# EAGLE design pca9685_32_V1 (EAGLE 6.2)
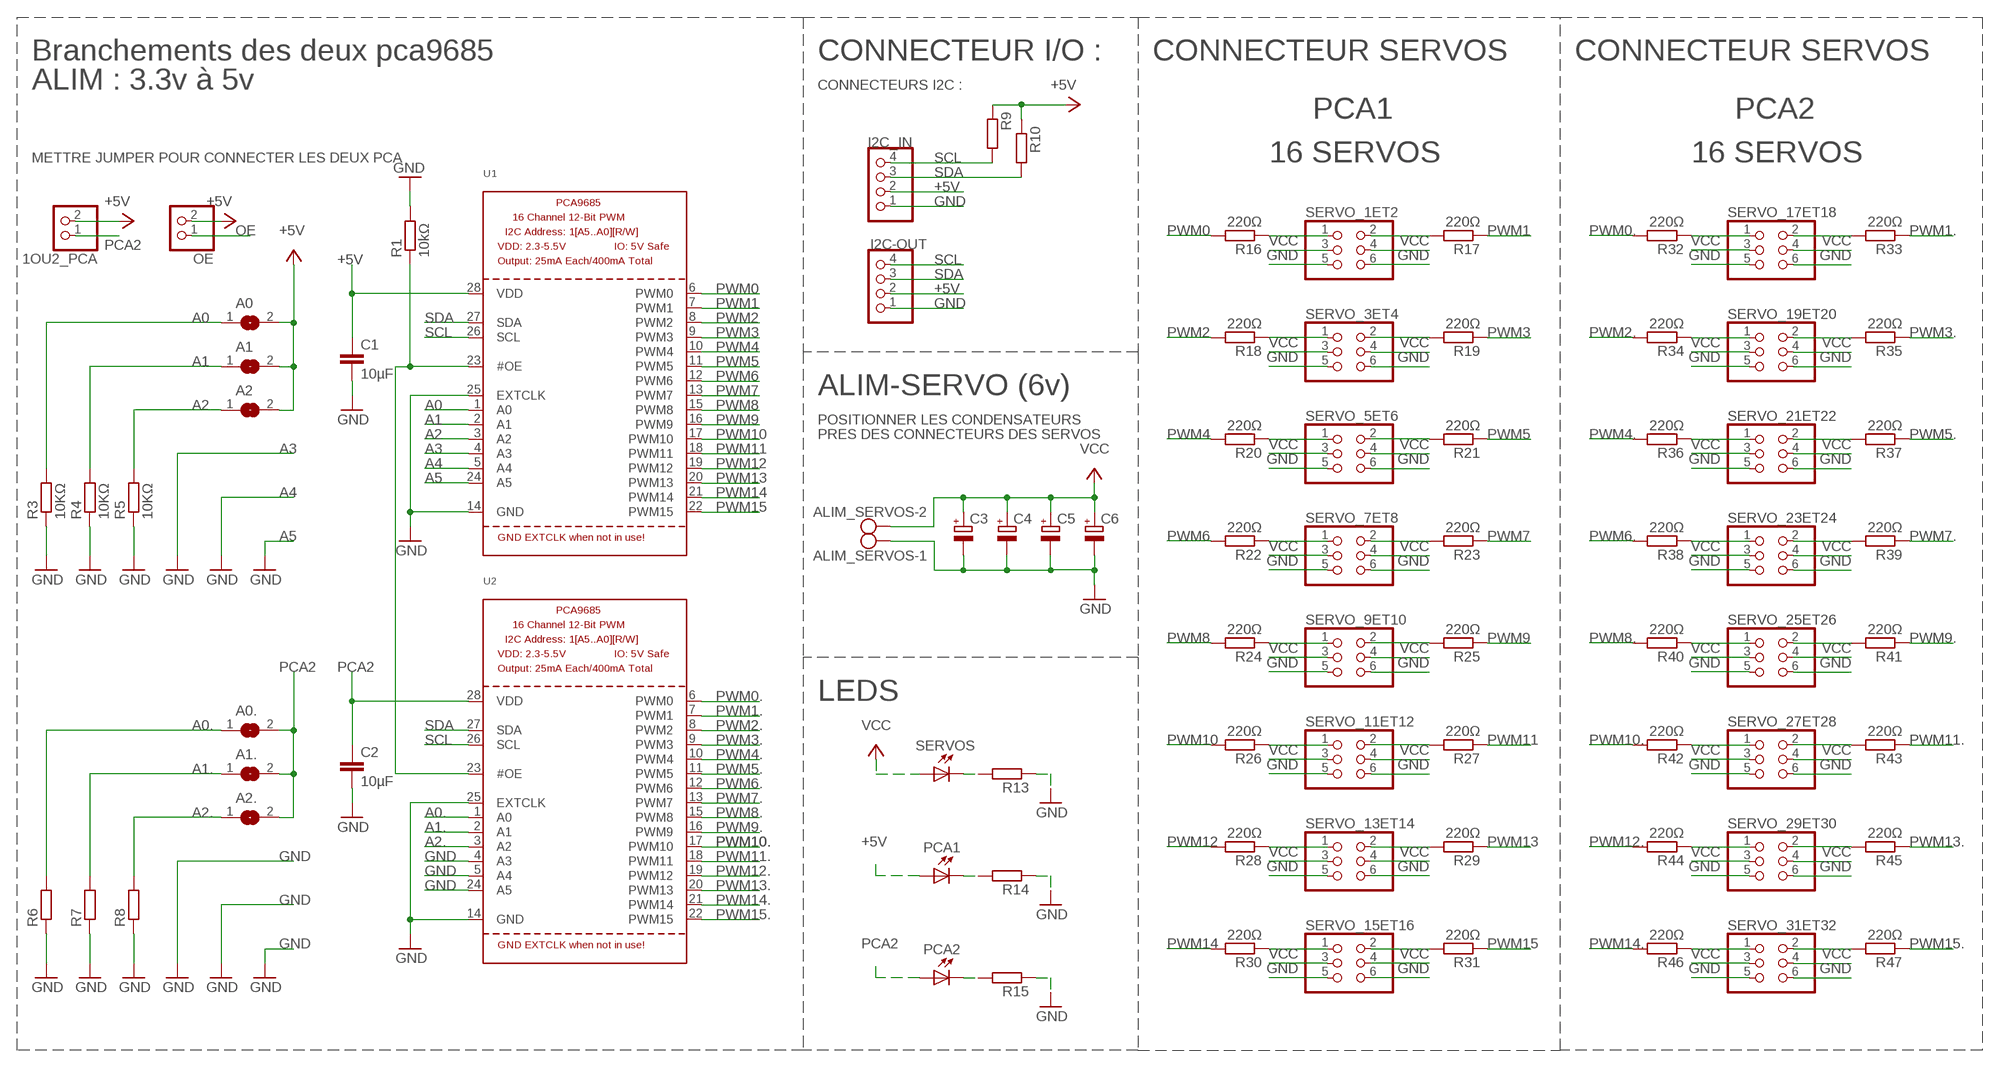
[diagram p0: schematic, sheet 1]

## Parts
1OU2_PCA  PINHD-1X2  [1X02]
A0  SOLDERJUMPERREFLOW_NOPASTE  [SOLDERJUMPER_REFLOW_NOPASTE]
A0.  SOLDERJUMPERREFLOW_NOPASTE  [SOLDERJUMPER_REFLOW_NOPASTE]
A1  SOLDERJUMPERREFLOW_NOPASTE  [SOLDERJUMPER_REFLOW_NOPASTE]
A1.  SOLDERJUMPERREFLOW_NOPASTE  [SOLDERJUMPER_REFLOW_NOPASTE]
A2  SOLDERJUMPERREFLOW_NOPASTE  [SOLDERJUMPER_REFLOW_NOPASTE]
A2.  SOLDERJUMPERREFLOW_NOPASTE  [SOLDERJUMPER_REFLOW_NOPASTE]
ALIM_SERVOS  AK500/2  [AK500/2]
C1  10µF  C-EUC0805  [C0805]
C2  10µF  C-EUC0805  [C0805]
C3  CPOL-EUE3.5-10  [E3,5-10]
C4  CPOL-EUE3.5-10  [E3,5-10]
C5  CPOL-EUE3.5-10  [E3,5-10]
C6  CPOL-EUE3.5-10  [E3,5-10]
I2C-OUT  PINHD-1X4  [1X04]
I2C_IN  PINHD-1X4  [1X04]
OE  PINHD-1X2  [1X02]
PCA1  LEDCHIP-LED0805  [CHIP-LED0805]
PCA2  LEDCHIP-LED0805  [CHIP-LED0805]
R1  10kΩ  R-EU_R0805  [R0805]
R3  10KΩ  R-EU_R1206  [R1206]
R4  10KΩ  R-EU_R1206  [R1206]
R5  10KΩ  R-EU_R1206  [R1206]
R6  R-EU_R1206  [R1206]
R7  R-EU_R1206  [R1206]
R8  R-EU_R1206  [R1206]
R9  R-EU_R0805  [R0805]
R10  R-EU_R0805  [R0805]
R13  R-EU_R0805  [R0805]
R14  R-EU_R0805  [R0805]
R15  R-EU_R0805  [R0805]
R16  220Ω  R-EU_R0805  [R0805]
R17  220Ω  R-EU_R0805  [R0805]
R18  220Ω  R-EU_R0805  [R0805]
R19  220Ω  R-EU_R0805  [R0805]
R20  220Ω  R-EU_R0805  [R0805]
R21  220Ω  R-EU_R0805  [R0805]
R22  220Ω  R-EU_R0805  [R0805]
R23  220Ω  R-EU_R0805  [R0805]
R24  220Ω  R-EU_R0805  [R0805]
R25  220Ω  R-EU_R0805  [R0805]
R26  220Ω  R-EU_R0805  [R0805]
R27  220Ω  R-EU_R0805  [R0805]
R28  220Ω  R-EU_R0805  [R0805]
R29  220Ω  R-EU_R0805  [R0805]
R30  220Ω  R-EU_R0805  [R0805]
R31  220Ω  R-EU_R0805  [R0805]
R32  220Ω  R-EU_R0805  [R0805]
R33  220Ω  R-EU_R0805  [R0805]
R34  220Ω  R-EU_R0805  [R0805]
R35  220Ω  R-EU_R0805  [R0805]
R36  220Ω  R-EU_R0805  [R0805]
R37  220Ω  R-EU_R0805  [R0805]
R38  220Ω  R-EU_R0805  [R0805]
R39  220Ω  R-EU_R0805  [R0805]
R40  220Ω  R-EU_R0805  [R0805]
R41  220Ω  R-EU_R0805  [R0805]
R42  220Ω  R-EU_R0805  [R0805]
R43  220Ω  R-EU_R0805  [R0805]
R44  220Ω  R-EU_R0805  [R0805]
R45  220Ω  R-EU_R0805  [R0805]
R46  220Ω  R-EU_R0805  [R0805]
R47  220Ω  R-EU_R0805  [R0805]
SERVO_1ET2  PINHD-2X3  [2X03]
SERVO_3ET4  PINHD-2X3  [2X03]
SERVO_5ET6  PINHD-2X3  [2X03]
SERVO_7ET8  PINHD-2X3  [2X03]
SERVO_9ET10  PINHD-2X3  [2X03]
SERVO_11ET12  PINHD-2X3  [2X03]
SERVO_13ET14  PINHD-2X3  [2X03]
SERVO_15ET16  PINHD-2X3  [2X03]
SERVO_17ET18  PINHD-2X3  [2X03]
SERVO_19ET20  PINHD-2X3  [2X03]
SERVO_21ET22  PINHD-2X3  [2X03]
SERVO_23ET24  PINHD-2X3  [2X03]
SERVO_25ET26  PINHD-2X3  [2X03]
SERVO_27ET28  PINHD-2X3  [2X03]
SERVO_29ET30  PINHD-2X3  [2X03]
SERVO_31ET32  PINHD-2X3  [2X03]
SERVOS  LEDCHIP-LED0805  [CHIP-LED0805]
U1  PCA9685  [TSSOP28]
U2  PCA9685  [TSSOP28]

## Nets
+5V: 1OU2_PCA.2 A0.2 A1.2 A2.2 C1.1 I2C-OUT.2 I2C_IN.2 OE.2 PCA1.A R9.1 R10.1 U1.28(VDD)
A0: A0.1 R3.2 U1.1(A0)
A0.: A0..1 R6.2 U2.1(A0)
A1: A1.1 R4.2 U1.2(A1)
A1.: A1..1 R7.2 U2.2(A1)
A2: A2.1 R5.2 U1.3(A2)
A2.: A2..1 R8.2 U2.3(A2)
GND: ALIM_SERVOS.1 C1.2 C2.2 C3.- C4.- C5.- C6.- I2C-OUT.1 I2C_IN.1 R1.2 R3.1 R4.1 R5.1 R6.1 R7.1 R8.1 R13.1 R14.1 R15.1 U1.4(A3) U1.5(A4) U1.14(GND) U1.24(A5) U1.25(EXTCLK) U2.4(A3) U2.5(A4) U2.14(GND) U2.24(A5) U2.25(EXTCLK)
N$1: R13.2 SERVOS.C
N$2: PCA1.C R14.2
N$3: PCA2.C R15.2
N$4: R18.1 SERVO_3ET4.1
N$5: R19.2 SERVO_3ET4.2
N$6: R22.1 SERVO_7ET8.1
N$7: R23.2 SERVO_7ET8.2
N$8: R16.1 SERVO_1ET2.1
N$9: R17.2 SERVO_1ET2.2
N$10: R21.2 SERVO_5ET6.2
N$11: R20.1 SERVO_5ET6.1
N$12: R24.1 SERVO_9ET10.1
N$13: R25.2 SERVO_9ET10.2
N$14: R27.2 SERVO_11ET12.2
N$15: R26.1 SERVO_11ET12.1
N$16: R28.1 SERVO_13ET14.1
N$17: R29.2 SERVO_13ET14.2
N$18: R30.1 SERVO_15ET16.1
N$19: R31.2 SERVO_15ET16.2
N$20: R32.1 SERVO_17ET18.1
N$21: R34.1 SERVO_19ET20.1
N$22: R36.1 SERVO_21ET22.1
N$23: R38.1 SERVO_23ET24.1
N$24: R39.2 SERVO_23ET24.2
N$25: R37.2 SERVO_21ET22.2
N$27: R35.2 SERVO_19ET20.2
N$28: R33.2 SERVO_17ET18.2
N$29: R46.1 SERVO_31ET32.1
N$30: R47.2 SERVO_31ET32.2
N$31: R45.2 SERVO_29ET30.2
N$32: R44.1 SERVO_29ET30.1
N$33: R43.2 SERVO_27ET28.2
N$34: R42.1 SERVO_27ET28.1
N$35: R40.1 SERVO_25ET26.1
N$36: R41.2 SERVO_25ET26.2
OE: OE.1 R1.1 U1.23(#OE) U2.23(#OE)
PCA2: 1OU2_PCA.1 A0..2 A1..2 A2..2 C2.1 PCA2.A U2.28(VDD)
PWM0: R16.2 U1.6(PWM0)
PWM0.: R32.2 U2.6(PWM0)
PWM1: R17.1 U1.7(PWM1)
PWM1.: R33.1 U2.7(PWM1)
PWM2: R18.2 U1.8(PWM2)
PWM2.: R34.2 U2.8(PWM2)
PWM3: R19.1 U1.9(PWM3)
PWM3.: R35.1 U2.9(PWM3)
PWM4: R20.2 U1.10(PWM4)
PWM4.: R36.2 U2.10(PWM4)
PWM5: R21.1 U1.11(PWM5)
PWM5.: R37.1 U2.11(PWM5)
PWM6: R22.2 U1.12(PWM6)
PWM6.: R38.2 U2.12(PWM6)
PWM7: R23.1 U1.13(PWM7)
PWM7.: R39.1 U2.13(PWM7)
PWM8: R24.2 U1.15(PWM8)
PWM8.: R40.2 U2.15(PWM8)
PWM9: R25.1 U1.16(PWM9)
PWM9.: R41.1 U2.16(PWM9)
PWM10: R26.2 U1.17(PWM10)
PWM10.: R42.2 U2.17(PWM10)
PWM11: R27.1 U1.18(PWM11)
PWM11.: R43.1 U2.18(PWM11)
PWM12: R28.2 U1.19(PWM12)
PWM12.: R44.2 U2.19(PWM12)
PWM13: R29.1 U1.20(PWM13)
PWM13.: R45.1 U2.20(PWM13)
PWM14: R30.2 U1.21(PWM14)
PWM14.: R46.2 U2.21(PWM14)
PWM15: R31.1 U1.22(PWM15)
PWM15.: R47.1 U2.22(PWM15)
SCL: I2C-OUT.4 I2C_IN.4 R9.2 U1.26(SCL) U2.26(SCL)
SDA: I2C-OUT.3 I2C_IN.3 R10.2 U1.27(SDA) U2.27(SDA)
VCC: ALIM_SERVOS.2 C3.+ C4.+ C5.+ C6.+ SERVOS.A
Unconnected: SERVO_1ET2.3 SERVO_1ET2.4 SERVO_1ET2.5 SERVO_1ET2.6 SERVO_3ET4.3 SERVO_3ET4.4 SERVO_3ET4.5 SERVO_3ET4.6 SERVO_5ET6.3 SERVO_5ET6.4 SERVO_5ET6.5 SERVO_5ET6.6 SERVO_7ET8.3 SERVO_7ET8.4 SERVO_7ET8.5 SERVO_7ET8.6 SERVO_9ET10.3 SERVO_9ET10.4 SERVO_9ET10.5 SERVO_9ET10.6 SERVO_11ET12.3 SERVO_11ET12.4 SERVO_11ET12.5 SERVO_11ET12.6 SERVO_13ET14.3 SERVO_13ET14.4 SERVO_13ET14.5 SERVO_13ET14.6 SERVO_15ET16.3 SERVO_15ET16.4 SERVO_15ET16.5 SERVO_15ET16.6 SERVO_17ET18.3 SERVO_17ET18.4 SERVO_17ET18.5 SERVO_17ET18.6 SERVO_19ET20.3 SERVO_19ET20.4 SERVO_19ET20.5 SERVO_19ET20.6 SERVO_21ET22.3 SERVO_21ET22.4 SERVO_21ET22.5 SERVO_21ET22.6 SERVO_23ET24.3 SERVO_23ET24.4 SERVO_23ET24.5 SERVO_23ET24.6 SERVO_25ET26.3 SERVO_25ET26.4 SERVO_25ET26.5 SERVO_25ET26.6 SERVO_27ET28.3 SERVO_27ET28.4 SERVO_27ET28.5 SERVO_27ET28.6 SERVO_29ET30.3 SERVO_29ET30.4 SERVO_29ET30.5 SERVO_29ET30.6 SERVO_31ET32.3 SERVO_31ET32.4 SERVO_31ET32.5 SERVO_31ET32.6

## Notes on the sheet
- Branchements des deux pca9685 | CONNECTEUR I/O : | CONNECTEUR SERVOS | CONNECTEUR SERVOS
- ALIM : 3.3v à 5v | CONNECTEURS I2C :
- PCA1 | PCA2
- METTRE JUMPER POUR CONNECTER LES DEUX PCA | 16 SERVOS | 16 SERVOS
- ALIM-SERVO (6v)
- POSITIONNER LES CONDENSATEURS
- PRES DES CONNECTEURS DES SERVOS
- A3 | A3
- A4
- A5
- A4
- A5
- LEDS

## Library data of the parts
1OU2_PCA OE = pinhead:PINHD-1X2: PIN HEADER
A0 A0. A1 A1. A2 A2. = microbuilder:SOLDERJUMPER: SMD Solder JUMPER Solder the two pads together to create a connection, or remove the solder to break it. REFLOW - Use this footprint for solder paste and reflow ovens. WAVE - Use this footprint for hand-soldering (larger pads). CLOSED - Has a trace between the two pads to ensure it is closed by default. The trace needs to be cut to disable the jumper, and can be closed again by creating a solder bridge between the two pads.
ALIM_SERVOS = con-ptr500:AK500/2: CONNECTOR; OC_FARNELL: unknown; OC_NEWARK: unknown
C1 C2 = rcl:C-EU: CAPACITOR, European symbol
C3-C6 = rcl:CPOL-EU: POLARIZED CAPACITOR, European symbol
I2C-OUT I2C_IN = pinhead:PINHD-1X4: PIN HEADER
PCA1 PCA2 SERVOS = led:LED: LED OSRAM: - CHIPLED LG R971, LG N971, LY N971, LG Q971, LY Q971, LO R971, LY R971 LH N974, LH R974 LS Q976, LO Q976, LY Q976 LO Q996 - Hyper CHIPLED LW Q18S LB Q993, LB Q99A, LB R99A - SideLED LS A670, LO A670, LY A670, LG A670, LP A670 LB A673, LV A673, LT A673, LW A673 LH A674 LY A675 LS A676, LA A676, LO A676, LY A676, LW A676 LS A679, LY A679, LG A679 - Hyper Micro SIDELED® LS Y876, LA Y876, LO Y876, LY Y876 LT Y87S - SmartLED LW L88C, LW L88S LB L89C, LB L89S, LG L890 LS L89K, LO L89K, LY L89K LS L896, LA L896, LO L896, LY L896 - TOPLED LS T670, LO T670, LY T670, LG T670, LP T670 LSG T670, LSP T670, LSY T670, LOP T670, LYG T670 LG T671, LOG T671, LSG T671 LB T673, LV T673, LT T673, LW T673 LH T674 LS T676, LA T676, LO T676, LY T676, LB T676, LH T676, LSB T676, LW T676 LB T67C, LV T67C, LT T67C, LS T67K, LO T67K, LY T67K, LW E67C LS E67B, LA E67B, LO E67B, LY E67B, LB E67C, LV E67C, LT E67C LW T67C LS T679, LY T679, LG T679 LS T770, LO T770, LY T770, LG T770, LP T770 LB T773, LV T773, LT T773, LW T773 LH T774 LS E675, LA E675, LY E675, LS T675 LS T776, LA T776, LO T776, LY T776, LB T776 LHGB T686 LT T68C, LB T68C - Hyper Mini TOPLED® LB M676 - Mini TOPLED Santana® LG M470 LS M47K, LO M47K, LY M47K Source: http://www.osram.convergy.de LUXEON: - LUMILED® LXK2-PW12-R00, LXK2-PW12-S00, LXK2-PW14-U00, LXK2-PW14-V00 LXK2-PM12-R00, LXK2-PM12-S00, LXK2-PM14-U00 LXK2-PE12-Q00, LXK2-PE12-R00, LXK2-PE12-S00, LXK2-PE14-T00, LXK2-PE14-U00 LXK2-PB12-K00, LXK2-PB12-L00, LXK2-PB12-M00, LXK2-PB14-N00, LXK2-PB14-P00, LXK2-PB14-Q00 LXK2-PR12-L00, LXK2-PR12-M00, LXK2-PR14-Q00, LXK2-PR14-R00 LXK2-PD12-Q00, LXK2-PD12-R00, LXK2-PD12-S00 LXK2-PH12-R00, LXK2-PH12-S00 LXK2-PL12-P00, LXK2-PL12-Q00, LXK2-PL12-R00 Source: www.luxeon.com KINGBRIGHT: KA-3528ASYC Source: www.kingbright.com
R1 R3-R10 R13-R47 = rcl:R-EU_: RESISTOR, European symbol
SERVO_1ET2 SERVO_3ET4 SERVO_5ET6 SERVO_7ET8 SERVO_9ET10 SERVO_11ET12 SERVO_13ET14 SERVO_15ET16 SERVO_17ET18 SERVO_19ET20 SERVO_21ET22 SERVO_23ET24 SERVO_25ET26 SERVO_27ET28 SERVO_29ET30 SERVO_31ET32 = SparkFun-Retired:PINHD-2X3: PIN HEADER
U1 U2 = adafruit:PCA9685: PCA9685 - 16 Channel 12-Bit I2C PWM Controller 5.0V tolerant 16 channel, 12-bit I2C PWM controller with 25mA per output (max. 400mA total) Digikey: 568-5931-1-ND

## Board
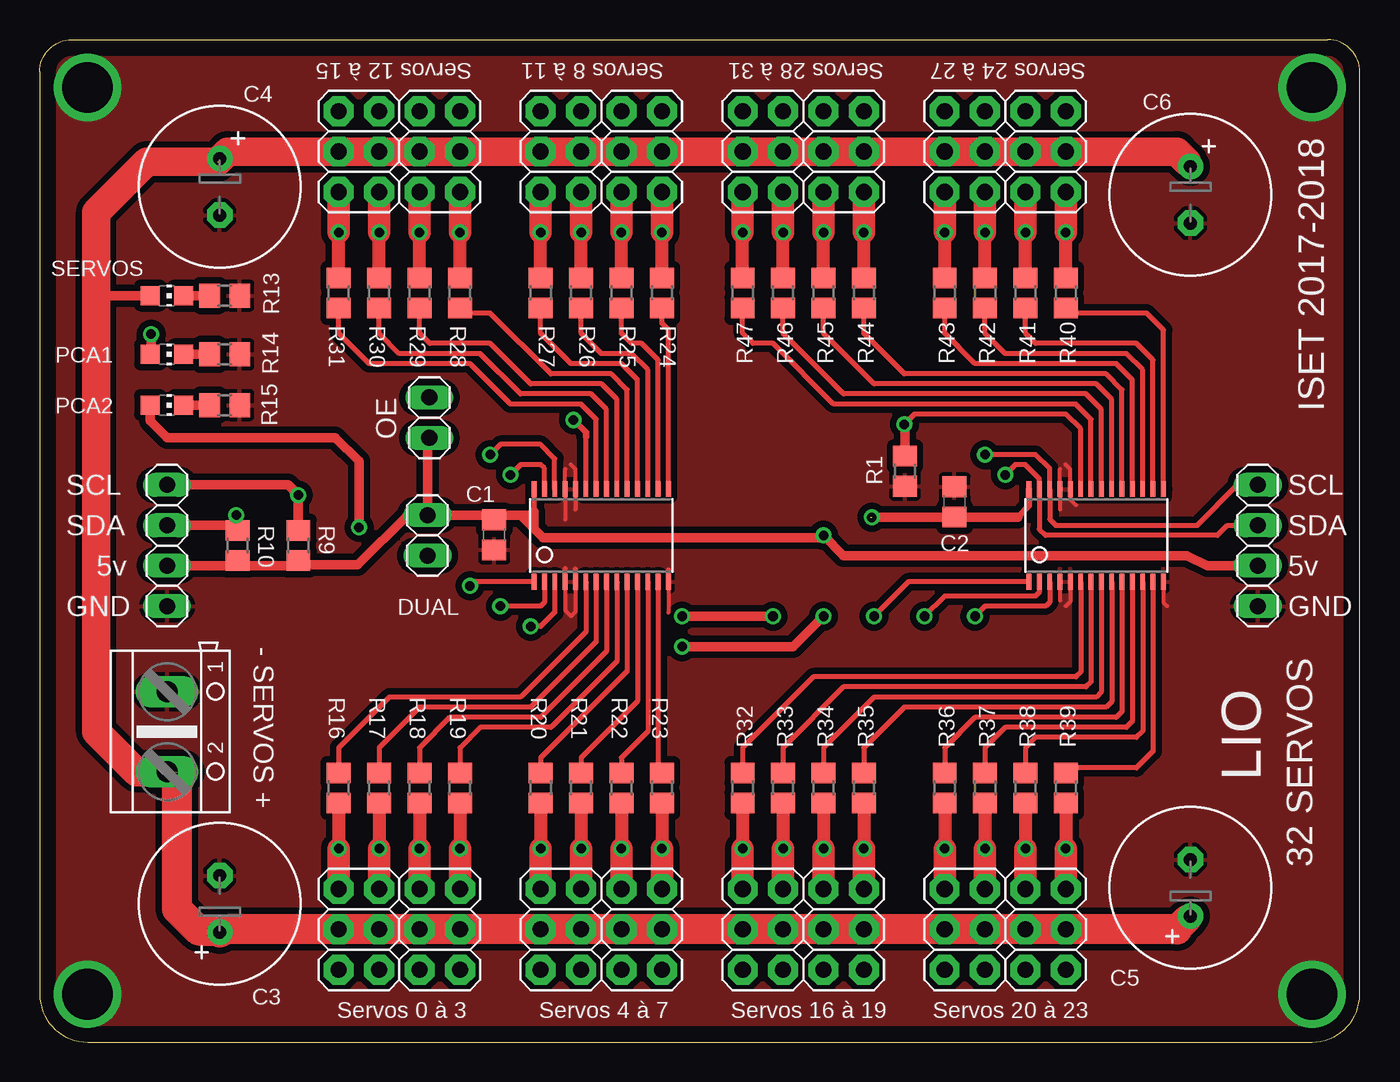
[diagram p1: board, top side]
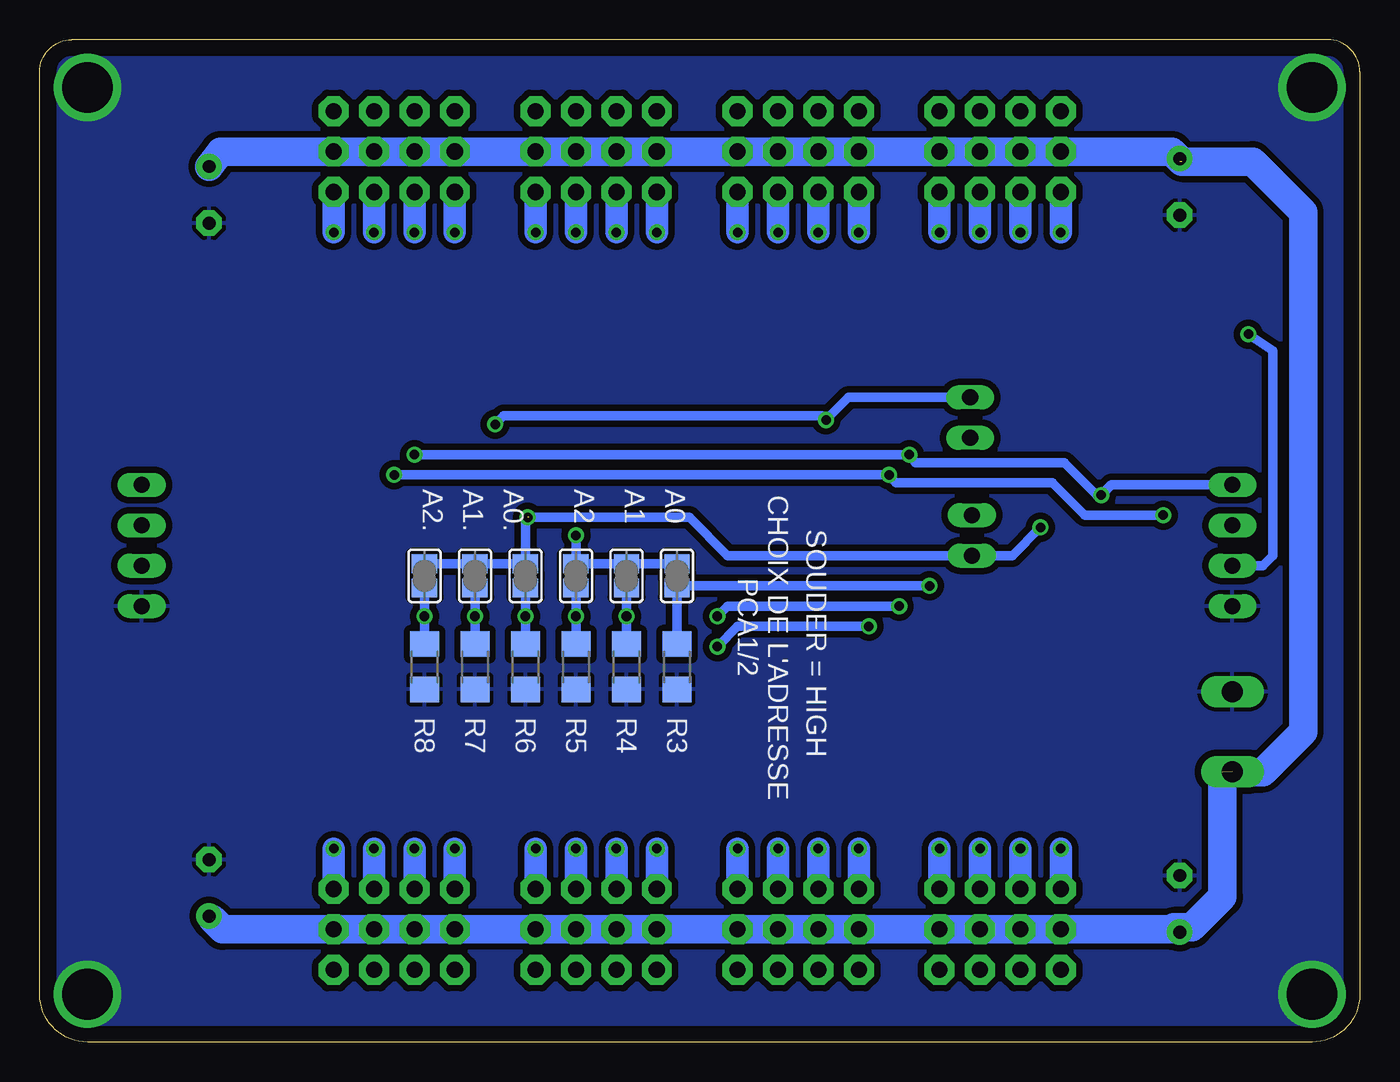
[diagram p2: board, bottom side, seen from below]

Size 83 x 63 mm. Coordinates in mm from the lower left corner, seen from the top.
Outline: 0,61 arc-90 2,63 81,63 arc-90 83,61 83,3 arc-90 80,0 3,0 arc-90 0,3 0,61
Copper layers (1*16): Top 0.035mm / dielectric 1.5mm / Bottom 0.035mm
Design rules: minimum track width 10mil, minimum drill 24mil, track to track 8mil, track to pad 8mil, pad to pad 8mil, via to via 8mil, smd to smd 8mil, copper to edge 40mil, drill to drill 8mil, minimum pad ring 10mil, minimum via ring 8mil, stop-mask expansion 4mil, vias tented up to drill 0mil, thermal gap 10mil

### Footprints (pad centres in the part's own frame; a part is rotated, then mirrored left to right if it is on the bottom)
1X02 = drill 1.016 long: 1 -1.27,0; 2 1.27,0
SOLDERJUMPER_REFLOW_NOPASTE = smd 1.168 x 1.6: 1 -0.762,0; 2 0.762,0
AK500/2 = drill 1.321 long: 1 -2.515,0; 2 2.515,0
C0805 = smd 1.3 x 1.5: 1 -0.95,0; 2 0.95,0
E3,5-10 = drill 0.813 pad 1.6: + -1.778,0 | drill 0.813 pad 1.6 octagon: - 1.778,0
1X04 = drill 1.016 long: 1 -3.81,0; 2 -1.27,0; 3 1.27,0; 4 3.81,0
CHIP-LED0805 = smd 1.2 x 1.2: A 0,-1.05; C 0,1.05
R0805 = smd 1.3 x 1.5: 1 -0.95,0; 2 0.95,0
R1206 = smd 1.6 x 1.803: 1 -1.422,0; 2 1.422,0
2X03 = drill 1.016 pad 1.88 octagon: 1 -2.54,-1.27; 2 -2.54,1.27; 3 0,-1.27; 4 0,1.27; 5 2.54,-1.27; 6 2.54,1.27
TSSOP28 = smd 0.305 x 0.991: 1 -4.225,-2.918; 2 -3.575,-2.918; 3 -2.925,-2.918; 4 -2.275,-2.918; 5 -1.625,-2.918; 6 -0.975,-2.918; 7 -0.325,-2.918; 8 0.325,-2.918; 9 0.975,-2.918; 10 1.625,-2.918; 11 2.275,-2.918; 12 2.925,-2.918; 13 3.575,-2.918; 14 4.225,-2.918; 15 4.225,2.918; 16 3.575,2.918; 17 2.925,2.918; 18 2.275,2.918; 19 1.625,2.918; 20 0.975,2.918; 21 0.325,2.918; 22 -0.325,2.918; 23 -0.975,2.918; 24 -1.625,2.918; 25 -2.275,2.918; 26 -2.925,2.918; 27 -3.575,2.918; 28 -4.225,2.918

### Placement (x,y rotation side)
1OU2_PCA  24.38,31.84 90 top
A0  42.93,29.3 90 bottom
A0.  52.45,29.3 90 bottom
A1  46.11,29.3 90 bottom
A1.  55.63,29.3 90 bottom
A2  49.28,29.3 90 bottom
A2.  58.81,29.3 90 bottom
ALIM_SERVOS  8.01,19.51 270 top
C1  28.58,31.88 270 top
C2  57.52,33.95 90 top
C3  11.32,8.69 90 top
C4  11.32,53.76 270 top
C5  72.36,9.69 90 top
C6  72.36,53.26 270 top
I2C-OUT  76.58,31.21 90 top
I2C_IN  8.01,31.21 90 top
OE  24.5,39.25 270 top
PCA1  7.99,43.23 270 top
PCA2  7.99,40.03 270 top
R1  54.4,35.88 270 top
R3  42.93,23.59 90 bottom
R4  46.11,23.59 90 bottom
R5  49.28,23.59 90 bottom
R6  52.45,23.59 90 bottom
R7  55.63,23.59 90 bottom
R8  58.81,23.59 90 bottom
R9  16.26,31.21 90 top
R10  12.45,31.21 90 top
R13  11.63,46.91 180 top
R14  11.63,43.23 180 top
R15  11.63,40.03 180 top
R16  18.8,15.97 90 top
R17  21.34,15.97 270 top
R18  23.88,15.97 90 top
R19  26.42,15.97 270 top
R20  31.5,15.97 90 top
R21  34.04,15.97 270 top
R22  36.58,15.97 90 top
R23  39.12,15.97 270 top
R24  39.12,47.09 270 top
R25  36.58,47.09 90 top
R26  34.04,47.09 270 top
R27  31.5,47.09 90 top
R28  26.42,47.09 270 top
R29  23.88,47.09 90 top
R30  21.34,47.09 270 top
R31  18.8,47.09 90 top
R32  44.2,15.97 90 top
R33  46.74,15.97 270 top
R34  49.28,15.97 90 top
R35  51.82,15.97 270 top
R36  56.9,15.97 90 top
R37  59.44,15.97 270 top
R38  61.98,15.97 90 top
R39  64.52,15.97 270 top
R40  64.52,47.09 270 top
R41  61.98,47.09 90 top
R42  59.44,47.09 270 top
R43  56.9,47.09 90 top
R44  51.82,47.09 270 top
R45  49.28,47.09 90 top
R46  46.74,47.09 270 top
R47  44.2,47.09 90 top
SERVO_1ET2  20.07,7.08 270 top
SERVO_3ET4  25.15,7.08 270 top
SERVO_5ET6  32.77,7.08 270 top
SERVO_7ET8  37.85,7.08 270 top
SERVO_9ET10  37.85,55.98 90 top
SERVO_11ET12  32.77,55.98 90 top
SERVO_13ET14  25.15,55.98 90 top
SERVO_15ET16  20.07,55.98 90 top
SERVO_17ET18  45.47,7.08 270 top
SERVO_19ET20  50.55,7.08 270 top
SERVO_21ET22  58.17,7.08 270 top
SERVO_23ET24  63.25,7.08 270 top
SERVO_25ET26  63.25,55.98 90 top
SERVO_27ET28  58.17,55.98 90 top
SERVO_29ET30  50.55,55.98 90 top
SERVO_31ET32  45.47,55.98 90 top
SERVOS  7.99,46.91 270 top
U1  35.31,31.84 0 top
U2  66.42,31.84 0 top

### Tracks (layer width: path | path; a pad name or v marks a point on that pad's centre or on a via)
+5V  (via drill 0.6)
  Top 0.305: 30.87,33.11 31.09,33.34 U1.28 | 16.11,29.94 R9.1 | R10.1 10.7,29.79 12.45,29.94
  Top 0.61: 31.09,32.26 31.63,31.71 49.14,31.71 v49.28,31.84 50.55,30.57 72.14,30.57 73.41,29.94 I2C-OUT.2 | 1OU2_PCA.2 28.5,33.11 | 28.5,33.11 30.23,33.11 | 30.23,33.11 30.87,33.11 | 16.11,29.94 12.45,29.94 I2C_IN.2 | 31.09,32.26 31.09,33.34 | 30.23,33.11 31.09,32.26 | 1OU2_PCA.2 23.12,33.11 20,30 16.52,30 R9.1 | C1.1 28.58,33.04 28.5,33.11 | 1OU2_PCA.2 24.38,38.11 OE.2 | v7,44.5 7,43.28 PCA1.A
  Bottom 0.305: A0.2 A1.2
  Bottom 0.61: A0.2 A2.2 v49.28,31.84 | I2C_IN.2 6.1,29.94 5.47,30.57 5.47,43.47 v7,44.5 | 1OU2_PCA.2 25.15,33.11
A0  (via drill 0.6)
  Top 0.305: U1.1 27.31,28.93 v27.05,28.67
  Bottom 0.305: 42.8,28.67 A0.1
  Bottom 0.61: v27.05,28.67 42.8,28.67 | A0.1 R3.2
A0.  (via drill 0.6)
  Top 0.305: U2.1 54.62,28.93 v52.45,26.77
  Bottom 0.305: 52.45,24.86 R6.2 | A0..1 52.45,28.67
  Bottom 0.61: A0..1 v52.45,26.77 R6.2
A1  (via drill 0.6)
  Top 0.305: U1.2 31.73,27.64 31.5,27.4 v28.96,27.4
  Top 0.61: v40.39,26.77 v46.11,26.77
  Bottom 0.61: v28.96,27.4 39.75,27.4 v40.39,26.77 | A1.1 v46.11,26.77 R4.2
A1.  (via drill 0.6)
  Top 0.305: U2.2 62.85,28.27 62.61,28.04 56.9,28.04 v55.63,26.77
  Bottom 0.305: v55.63,26.77 A1..1
  Bottom 0.61: A1..1 R7.2
A2  (via drill 0.6)
  Top 0.305: U1.3 32.39,27.02 31.5,26.13 v30.87,26.13
  Top 0.61: v40.39,24.86 47.38,24.86 v49.28,26.77
  Bottom 0.61: v30.87,26.13 39.12,26.13 v40.39,24.86 | A2.1 v49.28,26.77 R5.2
A2.  (via drill 0.6)
  Top 0.305: U2.3 63.5,27.65 63.25,27.4 59.44,27.4 v58.81,26.77
  Bottom 0.305: v58.81,26.77 A2..1
  Bottom 0.61: A2..1 R8.2
GND  (via drill 3.2)
  Top 0.254: U1.5 33.69,27.05 33.41,26.77 33.03,27.14 U1.4 | U1.14 39.53,26.98 | 33.03,36.02 U1.25 33.03,32.85 | 33.41,36.29 33.69,36.01 U1.24 33.69,33.47 | 64.15,36.02 U2.25 64.15,33.48 | 64.52,36.29 64.8,36.01 U2.24 64.8,34.1 65.16,33.75 | U2.4 64.15,27.77 | U2.5 64.8,27.68 64.52,27.4 | U2.14 70.65,27.62 70.87,27.4
  Top 0.305: 33.04,29.76 33.04,28.93 U1.4 | 33.68,29.74 33.68,28.93 U1.5 | 39.54,29.66 39.53,29.66 U1.14
  other vias: 3,60 80,60 3,3 80,3
  pour Top (isolate 0.406): -0.25,62.59 81.94,62.59 81.94,-0.17 -0.25,-0.17
  pour Bottom (isolate 0.406): -0.25,62.59 81.94,62.59 81.94,-0.17 -0.25,-0.17
N$1
  Top 0.61: SERVOS.C R13.2
N$2
  Top 0.61: PCA1.C R14.2
N$3
  Top 0.61: PCA2.C R15.2
N$4  (via drill 0.6)
  Top 0.813: R18.1 v23.88,12.16
  Top 1.422: SERVO_3ET4.1 v23.88,12.16
  Bottom 1.422: v23.88,12.16 SERVO_3ET4.1
N$5  (via drill 0.6)
  Top 0.813: R19.2 v26.42,12.16
  Top 1.422: SERVO_3ET4.2 v26.42,12.16
  Bottom 1.422: v26.42,12.16 SERVO_3ET4.2
N$6  (via drill 0.6)
  Top 0.813: R22.1 v36.58,12.16
  Top 1.422: SERVO_7ET8.1 v36.58,12.16
  Bottom 1.422: v36.58,12.16 SERVO_7ET8.1
N$7  (via drill 0.6)
  Top 0.813: R23.2 v39.12,12.16
  Top 1.422: SERVO_7ET8.2 v39.12,12.16
  Bottom 1.422: v39.12,12.16 SERVO_7ET8.2
N$8  (via drill 0.6)
  Top 0.813: R16.1 v18.8,12.16
  Top 1.422: SERVO_1ET2.1 v18.8,12.16
  Bottom 1.422: v18.8,12.16 SERVO_1ET2.1
N$9  (via drill 0.6)
  Top 0.813: R17.2 v21.34,12.16
  Top 1.422: SERVO_1ET2.2 v21.34,12.16
  Bottom 1.422: v21.34,12.16 SERVO_1ET2.2
N$10  (via drill 0.6)
  Top 0.813: R21.2 v34.04,12.16
  Top 1.422: SERVO_5ET6.2 v34.04,12.16
  Bottom 1.422: v34.04,12.16 SERVO_5ET6.2
N$11  (via drill 0.6)
  Top 0.813: R20.1 v31.5,12.16
  Top 1.422: SERVO_5ET6.1 v31.5,12.16
  Bottom 1.422: v31.5,12.16 SERVO_5ET6.1
N$12  (via drill 0.6)
  Top 0.813: R24.1 v39.12,50.9
  Top 1.422: v39.12,50.9 SERVO_9ET10.1
  Bottom 1.422: v39.12,50.9 SERVO_9ET10.1
N$13  (via drill 0.6)
  Top 0.813: R25.2 v36.58,50.9
  Top 1.422: v36.58,50.9 SERVO_9ET10.2
  Bottom 1.422: v36.58,50.9 SERVO_9ET10.2
N$14  (via drill 0.6)
  Top 0.813: R27.2 v31.5,50.9
  Top 1.422: v31.5,50.9 SERVO_11ET12.2
  Bottom 1.422: v31.5,50.9 SERVO_11ET12.2
N$15  (via drill 0.6)
  Top 0.813: R26.1 v34.04,50.9
  Top 1.422: v34.04,50.9 SERVO_11ET12.1
  Bottom 1.422: v34.04,50.9 SERVO_11ET12.1
N$16  (via drill 0.6)
  Top 0.813: R28.1 v26.42,50.9
  Top 1.422: v26.42,50.9 SERVO_13ET14.1
  Bottom 1.422: v26.42,50.9 SERVO_13ET14.1
N$17  (via drill 0.6)
  Top 0.813: R29.2 v23.88,50.9
  Top 1.422: v23.88,50.9 SERVO_13ET14.2
  Bottom 1.422: v23.88,50.9 SERVO_13ET14.2
N$18  (via drill 0.6)
  Top 0.813: R30.1 v21.34,50.9
  Top 1.422: v21.34,50.9 SERVO_15ET16.1
  Bottom 1.422: v21.34,50.9 SERVO_15ET16.1
N$19  (via drill 0.6)
  Top 0.813: R31.2 v18.8,50.9
  Top 1.422: v18.8,50.9 SERVO_15ET16.2
  Bottom 1.422: v18.8,50.9 SERVO_15ET16.2
N$20  (via drill 0.6)
  Top 0.813: R32.1 v44.2,12.16
  Top 1.422: SERVO_17ET18.1 v44.2,12.16
  Bottom 1.422: v44.2,12.16 SERVO_17ET18.1
N$21  (via drill 0.6)
  Top 0.813: R34.1 v49.28,12.16
  Top 1.422: SERVO_19ET20.1 v49.28,12.16
  Bottom 1.422: v49.28,12.16 SERVO_19ET20.1
N$22  (via drill 0.6)
  Top 0.813: R36.1 v56.9,12.16
  Top 1.422: SERVO_21ET22.1 v56.9,12.16
  Bottom 1.422: v56.9,12.16 SERVO_21ET22.1
N$23  (via drill 0.6)
  Top 0.813: R38.1 v61.98,12.16
  Top 1.422: SERVO_23ET24.1 v61.98,12.16
  Bottom 1.422: v61.98,12.16 SERVO_23ET24.1
N$24  (via drill 0.6)
  Top 0.813: R39.2 v64.52,12.16
  Top 1.422: SERVO_23ET24.2 v64.52,12.16
  Bottom 1.422: v64.52,12.16 SERVO_23ET24.2
N$25  (via drill 0.6)
  Top 0.813: R37.2 v59.44,12.16
  Top 1.422: SERVO_21ET22.2 v59.44,12.16
  Bottom 1.422: v59.44,12.16 SERVO_21ET22.2
N$27  (via drill 0.6)
  Top 0.813: R35.2 v51.82,12.16
  Top 1.422: SERVO_19ET20.2 v51.82,12.16
  Bottom 1.422: v51.82,12.16 SERVO_19ET20.2
N$28  (via drill 0.6)
  Top 0.813: R33.2 v46.74,12.16
  Top 1.422: SERVO_17ET18.2 v46.74,12.16
  Bottom 1.422: v46.74,12.16 SERVO_17ET18.2
N$29  (via drill 0.6)
  Top 0.813: R46.1 v46.74,50.9
  Top 1.422: SERVO_31ET32.1 v46.74,50.9
  Bottom 1.422: v46.74,50.9 SERVO_31ET32.1
N$30  (via drill 0.6)
  Top 0.813: R47.2 v44.2,50.9
  Top 1.422: SERVO_31ET32.2 v44.2,50.9
  Bottom 1.422: v44.2,50.9 SERVO_31ET32.2
N$31  (via drill 0.6)
  Top 0.813: R45.2 v49.28,50.9
  Top 1.422: SERVO_29ET30.2 v49.28,50.9
  Bottom 1.422: v49.28,50.9 SERVO_29ET30.2
N$32  (via drill 0.6)
  Top 0.813: R44.1 v51.82,50.9
  Top 1.422: SERVO_29ET30.1 v51.82,50.9
  Bottom 1.422: v51.82,50.9 SERVO_29ET30.1
N$33  (via drill 0.6)
  Top 0.813: R43.2 v56.9,50.9
  Top 1.422: SERVO_27ET28.2 v56.9,50.9
  Bottom 1.422: v56.9,50.9 SERVO_27ET28.2
N$34  (via drill 0.6)
  Top 0.813: R42.1 v59.44,50.9
  Top 1.422: SERVO_27ET28.1 v59.44,50.9
  Bottom 1.422: v59.44,50.9 SERVO_27ET28.1
N$35  (via drill 0.6)
  Top 0.813: R40.1 v64.52,50.9
  Top 1.422: SERVO_25ET26.1 v64.52,50.9
  Bottom 1.422: v64.52,50.9 SERVO_25ET26.1
N$36  (via drill 0.6)
  Top 0.813: R41.2 v61.98,50.9
  Top 1.422: SERVO_25ET26.2 v61.98,50.9
  Bottom 1.422: v61.98,50.9 SERVO_25ET26.2
OE  (via drill 0.6)
  Top 0.305: U2.23 65.45,38.53 64.52,39.47 55,39.47 v54.36,38.83 | U1.23 34.33,38.03
  Top 0.406: 54.31,38.77 v54.36,38.83 | 34.33,38.03 34.33,38.32 v33.56,39.1
  Top 0.61: R1.1 54.4,38.79 v54.36,38.83
  Bottom 0.61: v54.36,38.83 53.83,39.36 33.82,39.36 v33.56,39.1 32.14,40.52 OE.1
PCA2  (via drill 0.6)  (1 unrouted)
  Top 0.305: U2.28 62.2,34.8
  Top 0.406: U2.28 62.2,33.7 61.5,33
  Top 0.61: v20.07,32.34 20.07,36.5 18.57,38 8,38 6.95,39.05 PCA2.A | 61.5,33 57.5,33 | 57.5,33 52.34,33 v52.32,32.98 | C2.1 57.52,33.02 57.5,33
  Bottom 0.305: A1..2 55.12,30.07 55,29.94
  Bottom 0.61: A2..2 A1..2 A0..2 52.45,32.84 v52.32,32.98 | 52.24,32.98 42.16,32.98 39.75,30.57 1OU2_PCA.1 21.84,30.57 v20.07,32.34
PWM0
  Top 0.305: U1.6 34.33,25.79 30.23,21.68 21.98,21.68 18.8,18.51 R16.2
PWM0.
  Top 0.305: U2.6 65.45,23.25 65.16,22.95 48.64,22.95 44.2,18.51 R32.2
PWM1
  Top 0.305: U1.7 34.98,25.17 30.87,21.05 23.88,21.05 21.34,18.51 R17.1
PWM1.
  Top 0.305: U2.7 66.1,22.63 65.79,22.32 50.55,22.32 46.74,18.51 R33.1
  Top 0.61: 46.74,17.24 R33.1
PWM2
  Top 0.305: U1.8 35.64,24.55 31.5,20.41 25.78,20.41 23.88,18.51 R18.2
PWM2.
  Top 0.305: U2.8 66.75,22.01 66.42,21.68 52.45,21.68 49.28,18.51 R34.2
PWM3
  Top 0.305: U1.9 36.28,23.93 32.14,19.78 27.69,19.78 26.42,18.51 R19.1
PWM3.
  Top 0.305: U2.9 67.4,21.39 67.06,21.05 54.36,21.05 51.82,18.51 R35.1
PWM4
  Top 0.305: U1.10 36.94,23.31 31.5,17.88 R20.2
PWM4.
  Top 0.305: U2.10 68.05,20.77 67.69,20.41 58.81,20.41 56.9,18.51 R36.2
PWM5
  Top 0.305: U1.11 37.58,21.42 34.04,17.88 R21.1
PWM5.
  Top 0.305: U2.11 68.7,20.15 68.33,19.78 60.71,19.78 59.44,18.51 R37.1
PWM6
  Top 0.305: U1.12 38.23,19.53 36.58,17.88 R22.2
PWM6.
  Top 0.305: U2.12 69.35,19.53 68.97,19.14 62.61,19.14 61.98,18.51 R38.2
PWM7
  Top 0.305: U1.13 38.89,17.48
  Top 0.406: 38.89,17.48 39.12,17.24
  Top 0.61: R23.1 39.12,17.24
PWM7.
  Top 0.305: U2.13 70,18.27 68.97,17.24 64.67,17.24 R39.1
PWM8
  Top 0.305: U1.15 39.53,44.77 39.12,45.18 R24.2
PWM8.
  Top 0.305: U2.15 70.65,44.77 69.6,45.81 64.67,45.81 R40.2
PWM9
  Top 0.305: U1.16 38.89,42.88 37.85,43.91 37.22,43.91 36.58,44.55 R25.1
PWM9.
  Top 0.305: U2.16 70,42.88 68.97,43.91 62.61,43.91 61.98,44.55 R41.1
PWM10
  Top 0.305: U1.17 38.23,42.26 37.22,43.27 35.31,43.27 34.04,44.55 R26.2
PWM10.
  Top 0.305: U2.17 69.35,42.26 68.33,43.27 60.71,43.27 59.44,44.55 R42.2
PWM11
  Top 0.305: U1.18 37.58,41.63 36.58,42.64 33.41,42.64 31.5,44.55 R27.1
PWM11.
  Top 0.305: U2.18 68.7,41.63 67.69,42.64 58.81,42.64 56.9,44.55 R43.1 56.9,45.81
PWM12
  Top 0.305: U1.19 36.94,41.02 35.94,42.01 32.14,42.01 28.33,45.81 26.57,45.81 R28.2
PWM12.
  Top 0.305: U2.19 68.05,41.02 67.06,42.01 54.36,42.01 51.82,44.55 R44.2
PWM13
  Top 0.305: U1.20 36.28,40.4 35.31,41.37 30.87,41.37 28.33,43.91 24.52,43.91 23.88,44.55 R29.1
PWM13.
  Top 0.305: U2.20 67.4,40.4 66.42,41.37 52.45,41.37 49.28,44.55 R45.1
PWM14
  Top 0.305: U1.21 35.64,39.77 34.67,40.73 30.23,40.73 27.69,43.27 22.61,43.27 21.34,44.55 R30.2
PWM14.
  Top 0.305: U2.21 66.75,39.77 65.79,40.73 50.55,40.73 46.74,44.55 R46.2
PWM15
  Top 0.305: U1.22 34.98,39.16 34.04,40.1 29.59,40.1 27.05,42.64 20.7,42.64 18.8,44.55 R31.1
PWM15.
  Top 0.305: U2.22 66.1,39.16 65.16,40.1 49.92,40.1 46.11,43.91 44.83,43.91 44.2,44.55 R47.1 44.2,45.81
SCL  (via drill 0.6)
  Top 0.305: U1.26 32.39,36.67 31.5,37.56 28.96,37.56 v28.33,36.92 | v59.44,36.92 62.61,36.92 63.5,36.04 U2.26 63.5,32.86 63.89,32.48 72.78,32.48 75.31,35.02 I2C-OUT.4 | 16.26,32.48 R9.2
  Top 0.61: R9.2 v16.26,34.38 15.62,35.02 I2C_IN.4
  Bottom 0.61: v59.44,36.92 v28.33,36.92 28,36.5 27.92,36.42 18.57,36.42 16.53,34.38 v16.26,34.38 15.62,35.02 I2C_IN.4
SDA  (via drill 0.6)
  Top 0.305: U1.27 31.73,36.05 31.5,36.29 30.23,36.29 v29.59,35.66 | v60.71,35.66 61.34,36.29 61.98,36.29 62.85,35.42 U2.27 62.85,32.25 63.25,31.84 74.05,31.84 74.68,32.48 I2C-OUT.3 | R10.2 12.45,32.48
  Top 0.61: I2C_IN.3 12.45,32.48 12.45,33.02 v12.35,33.11
  Bottom 0.61: v12.35,33.11 17.3,33.11 19.34,35.16 29.16,35.16 29.5,35.5 v29.59,35.66 v60.71,35.66
VCC  (3 unrouted)
  Top 0.61: 71.5,7.08 69.73,7.59 C5.+ 72.14,7.71 | 71.5,55.98 72.01,55.34 C6.+ | SERVOS.A 3.65,46.91 3.56,47
  Top 1.778: 72.14,7.71 71.5,7.08 | 8.64,16.97 6.1,16.97 3.56,19.51 3.56,47 3.56,52.16 6.73,55.34 11.18,55.34 11.81,55.98 71.5,55.98 72.14,55.34
  Top 1.9: 71.5,7.08 11.81,7.08 | 8.64,16.97 8.64,8.36 10,7 11.23,7
  Top 1.93: 11.23,7 C3.+
  Bottom 1.016: 11.31,55.34 C4.+
  Bottom 1.778: C6.+ 71.63,55.98 11.81,55.98 11.18,55.34 6.73,55.34 3.56,52.16 3.56,19.51 6.1,16.97 8.64,16.97 8.64,9.12 10.55,7.21 11.68,7.21 11.81,7.08 71.5,7.08 72.14,7.71

### Text on the board
tNames: Servos 12 à 15 | Servos 8 à 11 | Servos 28 à 31 | Servos 24 à 27 | ISET 2017-2018 | SCL | SCL | SDA | SDA | 5v | 5v | GND | DUAL | GND | - SERVOS + | 32 SERVOS | LIO | Servos 0 à 3 | Servos 4 à 7 | Servos 16 à 19 | Servos 20 à 23
bNames: CHOIX DE L'ADRESSE | SOUDER = HIGH | PCA1/2